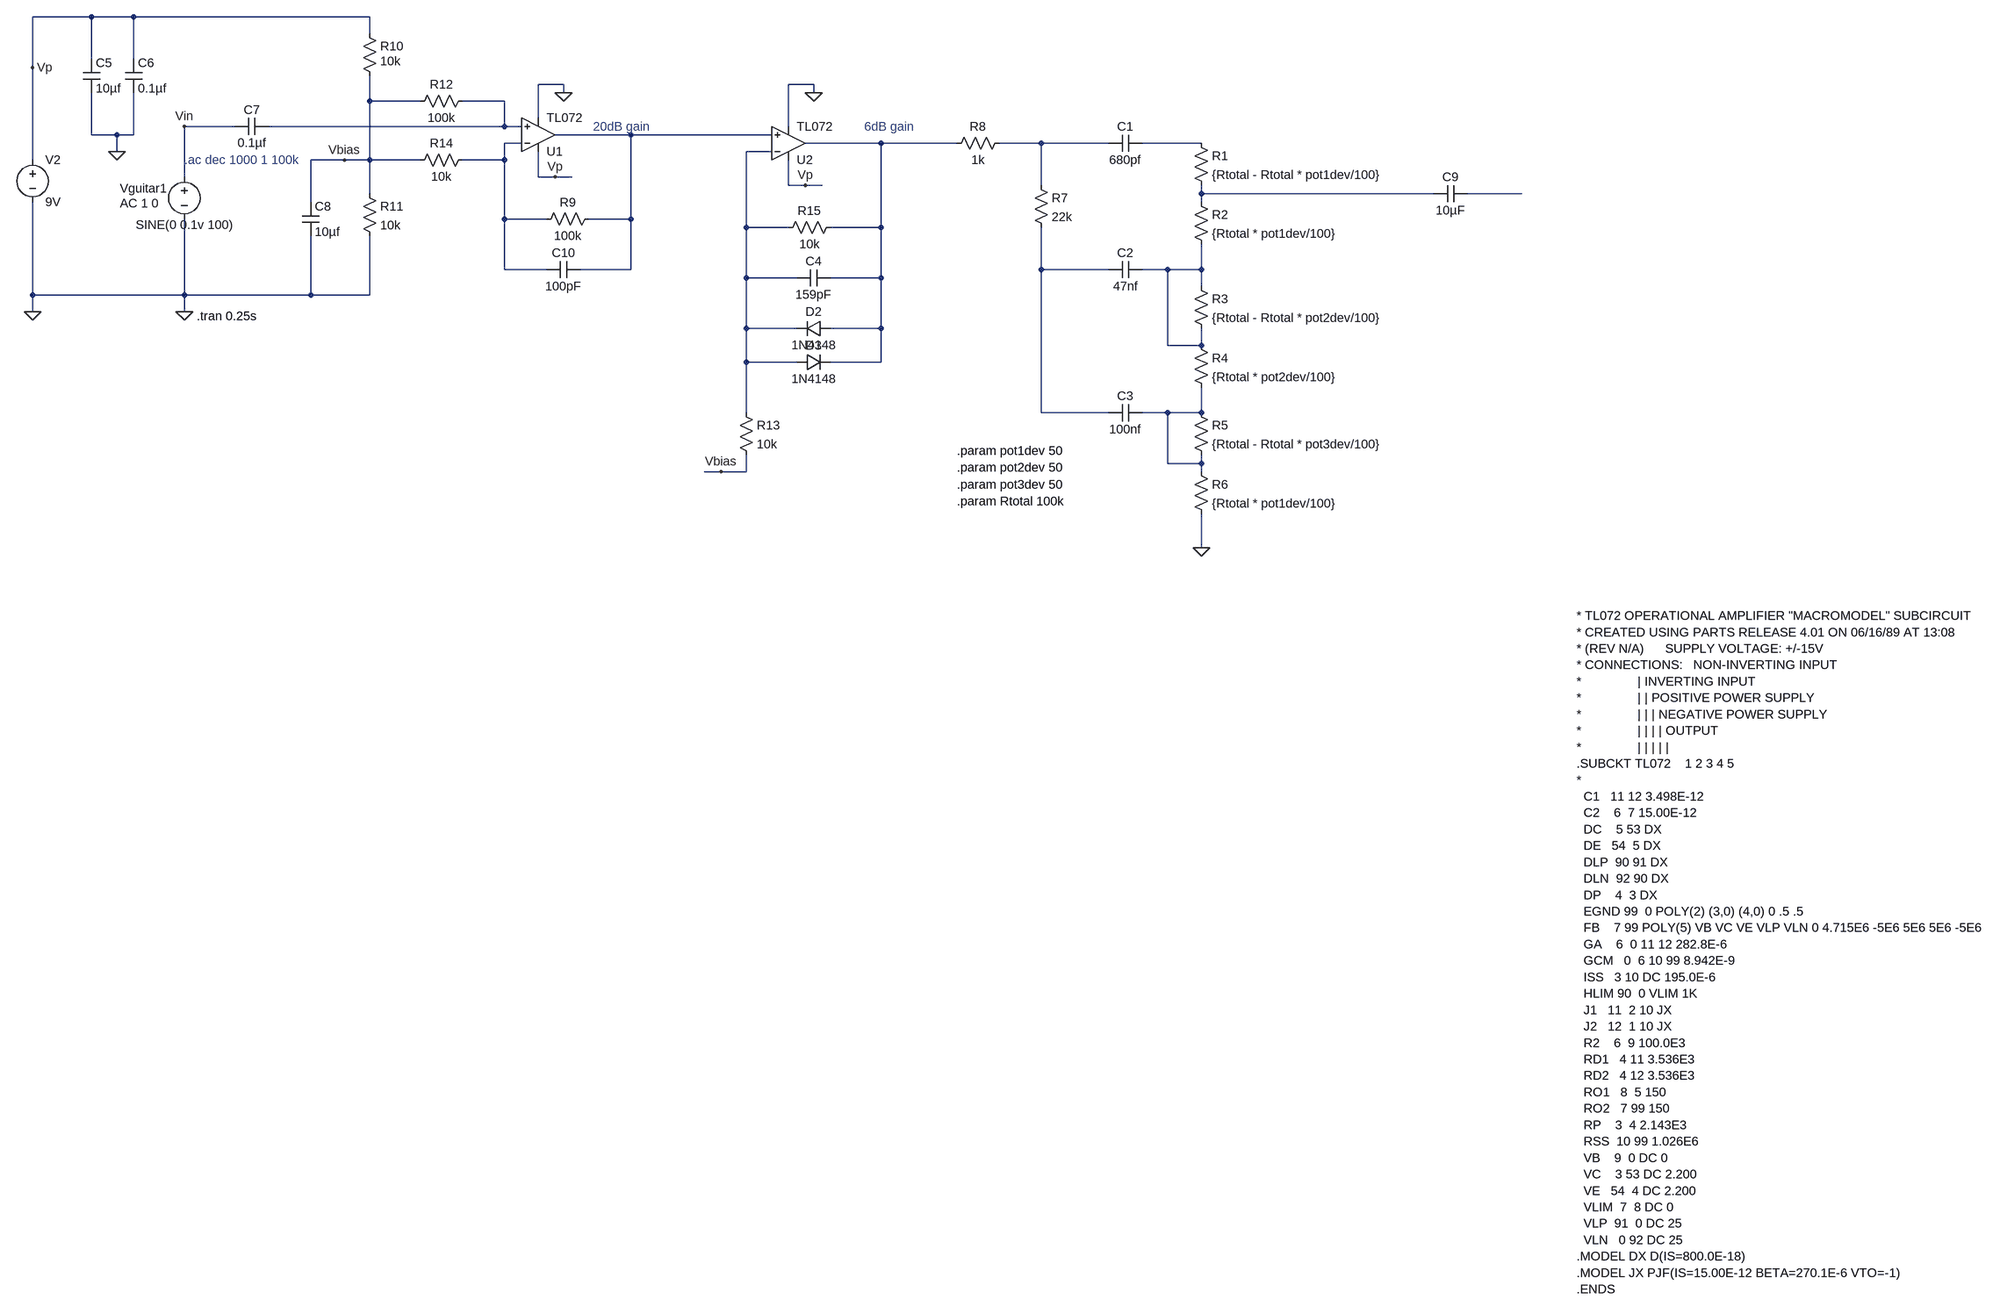
[diagram p0: schematic Guitar_Pedal_Sim.asc]
Guitar_Pedal_Sim.asc, the LTspice schematic file:
Version 4.1
SHEET 1 2080 2108
WIRE -2112 -432 -2224 -432
WIRE -2032 -432 -2112 -432
WIRE -1584 -432 -2032 -432
WIRE -1584 -400 -1584 -432
WIRE -2112 -352 -2112 -432
WIRE -2032 -352 -2032 -432
WIRE -2224 -336 -2224 -432
WIRE -1216 -304 -1264 -304
WIRE -736 -304 -784 -304
WIRE -1216 -288 -1216 -304
WIRE -736 -288 -736 -304
WIRE -1584 -272 -1584 -320
WIRE -1488 -272 -1584 -272
WIRE -1328 -272 -1408 -272
WIRE -1264 -240 -1264 -304
WIRE -1840 -224 -1936 -224
WIRE -1328 -224 -1328 -272
WIRE -1328 -224 -1776 -224
WIRE -1296 -224 -1328 -224
WIRE -784 -224 -784 -304
WIRE -2112 -208 -2112 -288
WIRE -2064 -208 -2112 -208
WIRE -2032 -208 -2032 -288
WIRE -2032 -208 -2064 -208
WIRE -1088 -208 -1232 -208
WIRE -816 -208 -1088 -208
WIRE -1296 -192 -1328 -192
WIRE -608 -192 -752 -192
WIRE -464 -192 -608 -192
WIRE -304 -192 -384 -192
WIRE -176 -192 -304 -192
WIRE 0 -192 -112 -192
WIRE -2064 -176 -2064 -208
WIRE -816 -176 -864 -176
WIRE -2224 -160 -2224 -336
WIRE -1632 -160 -1696 -160
WIRE -1584 -160 -1584 -272
WIRE -1584 -160 -1632 -160
WIRE -1488 -160 -1584 -160
WIRE -1328 -160 -1328 -192
WIRE -1328 -160 -1408 -160
WIRE -1936 -128 -1936 -224
WIRE -1264 -128 -1264 -176
WIRE -1232 -128 -1264 -128
WIRE -1200 -128 -1232 -128
WIRE -784 -112 -784 -160
WIRE -752 -112 -784 -112
WIRE -720 -112 -752 -112
WIRE -304 -112 -304 -192
WIRE -1584 -96 -1584 -160
WIRE 0 -96 0 -112
WIRE 448 -96 0 -96
WIRE 640 -96 512 -96
WIRE -1696 -80 -1696 -160
WIRE 0 -80 0 -96
WIRE -1328 -48 -1328 -160
WIRE -1248 -48 -1328 -48
WIRE -1088 -48 -1088 -208
WIRE -1088 -48 -1168 -48
WIRE -864 -32 -864 -176
WIRE -784 -32 -864 -32
WIRE -608 -32 -608 -192
WIRE -608 -32 -704 -32
WIRE -1328 48 -1328 -48
WIRE -1248 48 -1328 48
WIRE -1088 48 -1088 -48
WIRE -1088 48 -1184 48
WIRE -304 48 -304 -32
WIRE -176 48 -304 48
WIRE -64 48 -112 48
WIRE 0 48 0 0
WIRE 0 48 -64 48
WIRE -864 64 -864 -32
WIRE -768 64 -864 64
WIRE -608 64 -608 -32
WIRE -608 64 -704 64
WIRE 0 80 0 48
WIRE -2224 96 -2224 -80
WIRE -1936 96 -1936 -48
WIRE -1936 96 -2224 96
WIRE -1696 96 -1696 -16
WIRE -1696 96 -1936 96
WIRE -1584 96 -1584 -16
WIRE -1584 96 -1696 96
WIRE -2224 128 -2224 96
WIRE -1936 128 -1936 96
WIRE -864 160 -864 64
WIRE -768 160 -864 160
WIRE -608 160 -608 64
WIRE -608 160 -704 160
WIRE -64 192 -64 48
WIRE 0 192 0 160
WIRE 0 192 -64 192
WIRE -864 224 -864 160
WIRE -768 224 -864 224
WIRE -608 224 -608 160
WIRE -608 224 -704 224
WIRE -864 320 -864 224
WIRE -304 320 -304 48
WIRE -176 320 -304 320
WIRE -64 320 -112 320
WIRE 0 320 0 272
WIRE 0 320 -64 320
WIRE -64 416 -64 320
WIRE 0 416 0 400
WIRE 0 416 -64 416
WIRE -912 432 -944 432
WIRE -864 432 -864 400
WIRE -864 432 -912 432
WIRE 0 432 0 416
WIRE 0 576 0 512
FLAG -2224 -336 Vp
FLAG -1936 128 0
FLAG -2224 128 0
FLAG -1232 -128 Vp
FLAG -1216 -288 0
FLAG -2064 -176 0
FLAG -1936 -224 Vin
FLAG -1632 -160 Vbias
FLAG -736 -288 0
FLAG -752 -112 Vp
FLAG 0 576 0
FLAG -912 432 Vbias
SYMBOL res -16 -208 R0
SYMATTR InstName R1
SYMATTR Value {Rtotal - Rtotal * pot1dev/100}
SYMBOL res -16 -96 R0
SYMATTR InstName R2
SYMATTR Value {Rtotal * pot1dev/100}
SYMBOL res -16 64 R0
SYMATTR InstName R3
SYMATTR Value {Rtotal - Rtotal * pot2dev/100}
SYMBOL res -16 176 R0
SYMATTR InstName R4
SYMATTR Value {Rtotal * pot2dev/100}
SYMBOL res -16 304 R0
SYMATTR InstName R5
SYMATTR Value {Rtotal - Rtotal * pot3dev/100}
SYMBOL res -16 416 R0
SYMATTR InstName R6
SYMATTR Value {Rtotal * pot1dev/100}
SYMBOL cap -112 -208 R90
WINDOW 0 0 32 VBottom 2
WINDOW 3 32 32 VTop 2
SYMATTR InstName C1
SYMATTR Value 680pf
SYMBOL cap -112 32 R90
WINDOW 0 0 32 VBottom 2
WINDOW 3 32 32 VTop 2
SYMATTR InstName C2
SYMATTR Value 47nf
SYMBOL cap -112 304 R90
WINDOW 0 0 32 VBottom 2
WINDOW 3 32 32 VTop 2
SYMATTR InstName C3
SYMATTR Value 100nf
SYMBOL res -320 -128 R0
SYMATTR InstName R7
SYMATTR Value 22k
SYMBOL res -368 -208 R90
WINDOW 0 0 56 VBottom 2
WINDOW 3 32 56 VTop 2
SYMATTR InstName R8
SYMATTR Value 1k
SYMBOL OpAmps\\opamp2 -1264 -144 M180
SYMATTR InstName U1
SYMATTR Value TL072
SYMBOL res -1152 -64 R90
WINDOW 0 0 56 VBottom 2
WINDOW 3 32 56 VTop 2
SYMATTR InstName R9
SYMATTR Value 100k
SYMBOL voltage -1936 -144 R0
WINDOW 3 93 107 Right 2
WINDOW 123 -122 66 Left 2
WINDOW 39 0 0 Left 0
WINDOW 0 -122 38 Left 2
SYMATTR Value SINE(0 0.1v 100)
SYMATTR Value2 AC 1 0
SYMATTR InstName Vguitar1
SYMBOL voltage -2224 -176 R0
SYMATTR InstName V2
SYMATTR Value 9V
SYMBOL res -1600 -416 R0
WINDOW 3 36 68 Left 2
SYMATTR Value 10k
SYMATTR InstName R10
SYMBOL res -1600 -112 R0
SYMATTR InstName R11
SYMATTR Value 10k
SYMBOL cap -2128 -352 R0
SYMATTR InstName C5
SYMATTR Value 10µf
SYMBOL cap -2048 -352 R0
SYMATTR InstName C6
SYMATTR Value 0.1µf
SYMBOL cap -1776 -240 R90
WINDOW 0 0 32 VBottom 2
WINDOW 3 32 32 VTop 2
SYMATTR InstName C7
SYMATTR Value 0.1µf
SYMBOL cap -1712 -80 R0
SYMATTR InstName C8
SYMATTR Value 10µf
SYMBOL res -1392 -288 R90
WINDOW 0 0 56 VBottom 2
WINDOW 3 32 56 VTop 2
SYMATTR InstName R12
SYMATTR Value 100k
SYMBOL res -1392 -176 R90
WINDOW 0 0 56 VBottom 2
WINDOW 3 32 56 VTop 2
SYMATTR InstName R14
SYMATTR Value 10k
SYMBOL cap -1184 32 R90
WINDOW 0 0 32 VBottom 2
WINDOW 3 32 32 VTop 2
SYMATTR InstName C10
SYMATTR Value 100pF
SYMBOL OpAmps\\opamp2 -784 -128 M180
SYMATTR InstName U2
SYMATTR Value TL072
SYMBOL res -880 304 R0
SYMATTR InstName R13
SYMATTR Value 10k
SYMBOL res -688 -48 R90
WINDOW 0 0 56 VBottom 2
WINDOW 3 32 56 VTop 2
SYMATTR InstName R15
SYMATTR Value 10k
SYMBOL cap -704 48 R90
WINDOW 0 0 32 VBottom 2
WINDOW 3 32 32 VTop 2
SYMATTR InstName C4
SYMATTR Value 159pF
SYMBOL cap 512 -112 R90
WINDOW 0 0 32 VBottom 2
WINDOW 3 32 32 VTop 2
SYMATTR InstName C9
SYMATTR Value 10µF
SYMBOL diode -704 144 R90
WINDOW 0 0 32 VBottom 2
WINDOW 3 32 32 VTop 2
SYMATTR InstName D2
SYMATTR Value 1N4148
SYMBOL diode -768 240 R270
WINDOW 0 32 32 VTop 2
WINDOW 3 0 32 VBottom 2
SYMATTR InstName D3
SYMATTR Value 1N4148
TEXT -464 392 Left 2 !.param pot1dev 50
TEXT -464 424 Left 2 !.param pot2dev 50
TEXT -464 456 Left 2 !.param pot3dev 50
TEXT -464 488 Left 2 !.param Rtotal 100k
TEXT -1912 136 Left 2 !.tran 0.25s
TEXT 1288 944 Left 2 !* TL072 OPERATIONAL AMPLIFIER "MACROMODEL" SUBCIRCUIT\n* CREATED USING PARTS RELEASE 4.01 ON 06/16/89 AT 13:08\n* (REV N/A)      SUPPLY VOLTAGE: +/-15V\n* CONNECTIONS:   NON-INVERTING INPUT\n*                | INVERTING INPUT\n*                | | POSITIVE POWER SUPPLY\n*                | | | NEGATIVE POWER SUPPLY\n*                | | | | OUTPUT\n*                | | | | |\n.SUBCKT TL072    1 2 3 4 5\n*\n  C1   11 12 3.498E-12\n  C2    6  7 15.00E-12\n  DC    5 53 DX\n  DE   54  5 DX\n  DLP  90 91 DX\n  DLN  92 90 DX\n  DP    4  3 DX\n  EGND 99  0 POLY(2) (3,0) (4,0) 0 .5 .5\n  FB    7 99 POLY(5) VB VC VE VLP VLN 0 4.715E6 -5E6 5E6 5E6 -5E6\n  GA    6  0 11 12 282.8E-6\n  GCM   0  6 10 99 8.942E-9\n  ISS   3 10 DC 195.0E-6\n  HLIM 90  0 VLIM 1K\n  J1   11  2 10 JX\n  J2   12  1 10 JX\n  R2    6  9 100.0E3\n  RD1   4 11 3.536E3\n  RD2   4 12 3.536E3\n  RO1   8  5 150\n  RO2   7 99 150\n  RP    3  4 2.143E3\n  RSS  10 99 1.026E6\n  VB    9  0 DC 0\n  VC    3 53 DC 2.200\n  VE   54  4 DC 2.200\n  VLIM  7  8 DC 0\n  VLP  91  0 DC 25\n  VLN   0 92 DC 25\n.MODEL DX D(IS=800.0E-18)\n.MODEL JX PJF(IS=15.00E-12 BETA=270.1E-6 VTO=-1)\n.ENDS
TEXT -1160 -224 Left 2 ;20dB gain
TEXT -1936 -160 Left 2 ;.ac dec 1000 1 100k
TEXT -640 -224 Left 2 ;6dB gain

The netlist it stands for:
* Guitar_Pedal_Sim.asc
R1 N006 N008 {Rtotal - Rtotal * pot1dev/100}
R2 N008 N011 {Rtotal * pot1dev/100}
R3 N011 N011 {Rtotal - Rtotal * pot2dev/100}
R4 N011 N012 {Rtotal * pot2dev/100}
R5 N012 N012 {Rtotal - Rtotal * pot3dev/100}
R6 N012 0 {Rtotal * pot1dev/100}
C1 N006 N005 680pf
C2 N011 N010 47nf
C3 N012 N010 100nf
R7 N005 N010 22k
R8 N005 N004 1k
X§U1 N001 N003 Vp 0 N002 TL072  ; pins In+ In- V+ V- OUT
R9 N002 N003 100k
Vguitar1 Vin 0 SINE(0 0.1v 100) AC 1 0
V2 Vp 0 9V
R10 Vp Vbias 10k
R11 Vbias 0 10k
C5 Vp 0 10µf
C6 Vp 0 0.1µf
C7 N001 Vin 0.1µf
C8 Vbias 0 10µf
R12 N001 Vbias 100k
R14 N003 Vbias 10k
C10 N002 N003 100pF
X§U2 N002 N007 Vp 0 N004 TL072  ; pins In+ In- V+ V- OUT
R13 N007 Vbias 10k
R15 N004 N007 10k
C4 N004 N007 159pF
C9 N009 N008 10µF
D2 N004 N007 1N4148
D3 N007 N004 1N4148
.model D D
.lib standard.dio
.param pot1dev 50
.param pot2dev 50
.param pot3dev 50
.param Rtotal 100k
.tran 0.25s
* TL072 OPERATIONAL AMPLIFIER "MACROMODEL" SUBCIRCUIT
* CREATED USING PARTS RELEASE 4.01 ON 06/16/89 AT 13:08
* (REV N/A)      SUPPLY VOLTAGE: +/-15V
* CONNECTIONS:   NON-INVERTING INPUT
*                | INVERTING INPUT
*                | | POSITIVE POWER SUPPLY
*                | | | NEGATIVE POWER SUPPLY
*                | | | | OUTPUT
*                | | | | |
.SUBCKT TL072    1 2 3 4 5
*
  C1   11 12 3.498E-12
  C2    6  7 15.00E-12
  DC    5 53 DX
  DE   54  5 DX
  DLP  90 91 DX
  DLN  92 90 DX
  DP    4  3 DX
  EGND 99  0 POLY(2) (3,0) (4,0) 0 .5 .5
  FB    7 99 POLY(5) VB VC VE VLP VLN 0 4.715E6 -5E6 5E6 5E6 -5E6
  GA    6  0 11 12 282.8E-6
  GCM   0  6 10 99 8.942E-9
  ISS   3 10 DC 195.0E-6
  HLIM 90  0 VLIM 1K
  J1   11  2 10 JX
  J2   12  1 10 JX
  R2    6  9 100.0E3
  RD1   4 11 3.536E3
  RD2   4 12 3.536E3
  RO1   8  5 150
  RO2   7 99 150
  RP    3  4 2.143E3
  RSS  10 99 1.026E6
  VB    9  0 DC 0
  VC    3 53 DC 2.200
  VE   54  4 DC 2.200
  VLIM  7  8 DC 0
  VLP  91  0 DC 25
  VLN   0 92 DC 25
.MODEL DX D(IS=800.0E-18)
.MODEL JX PJF(IS=15.00E-12 BETA=270.1E-6 VTO=-1)
.ENDS
* 20dB gain
* .ac dec 1000 1 100k
* 6dB gain
.backanno
.end